# Altium schematic sheet Regulator.SchDoc
size A3
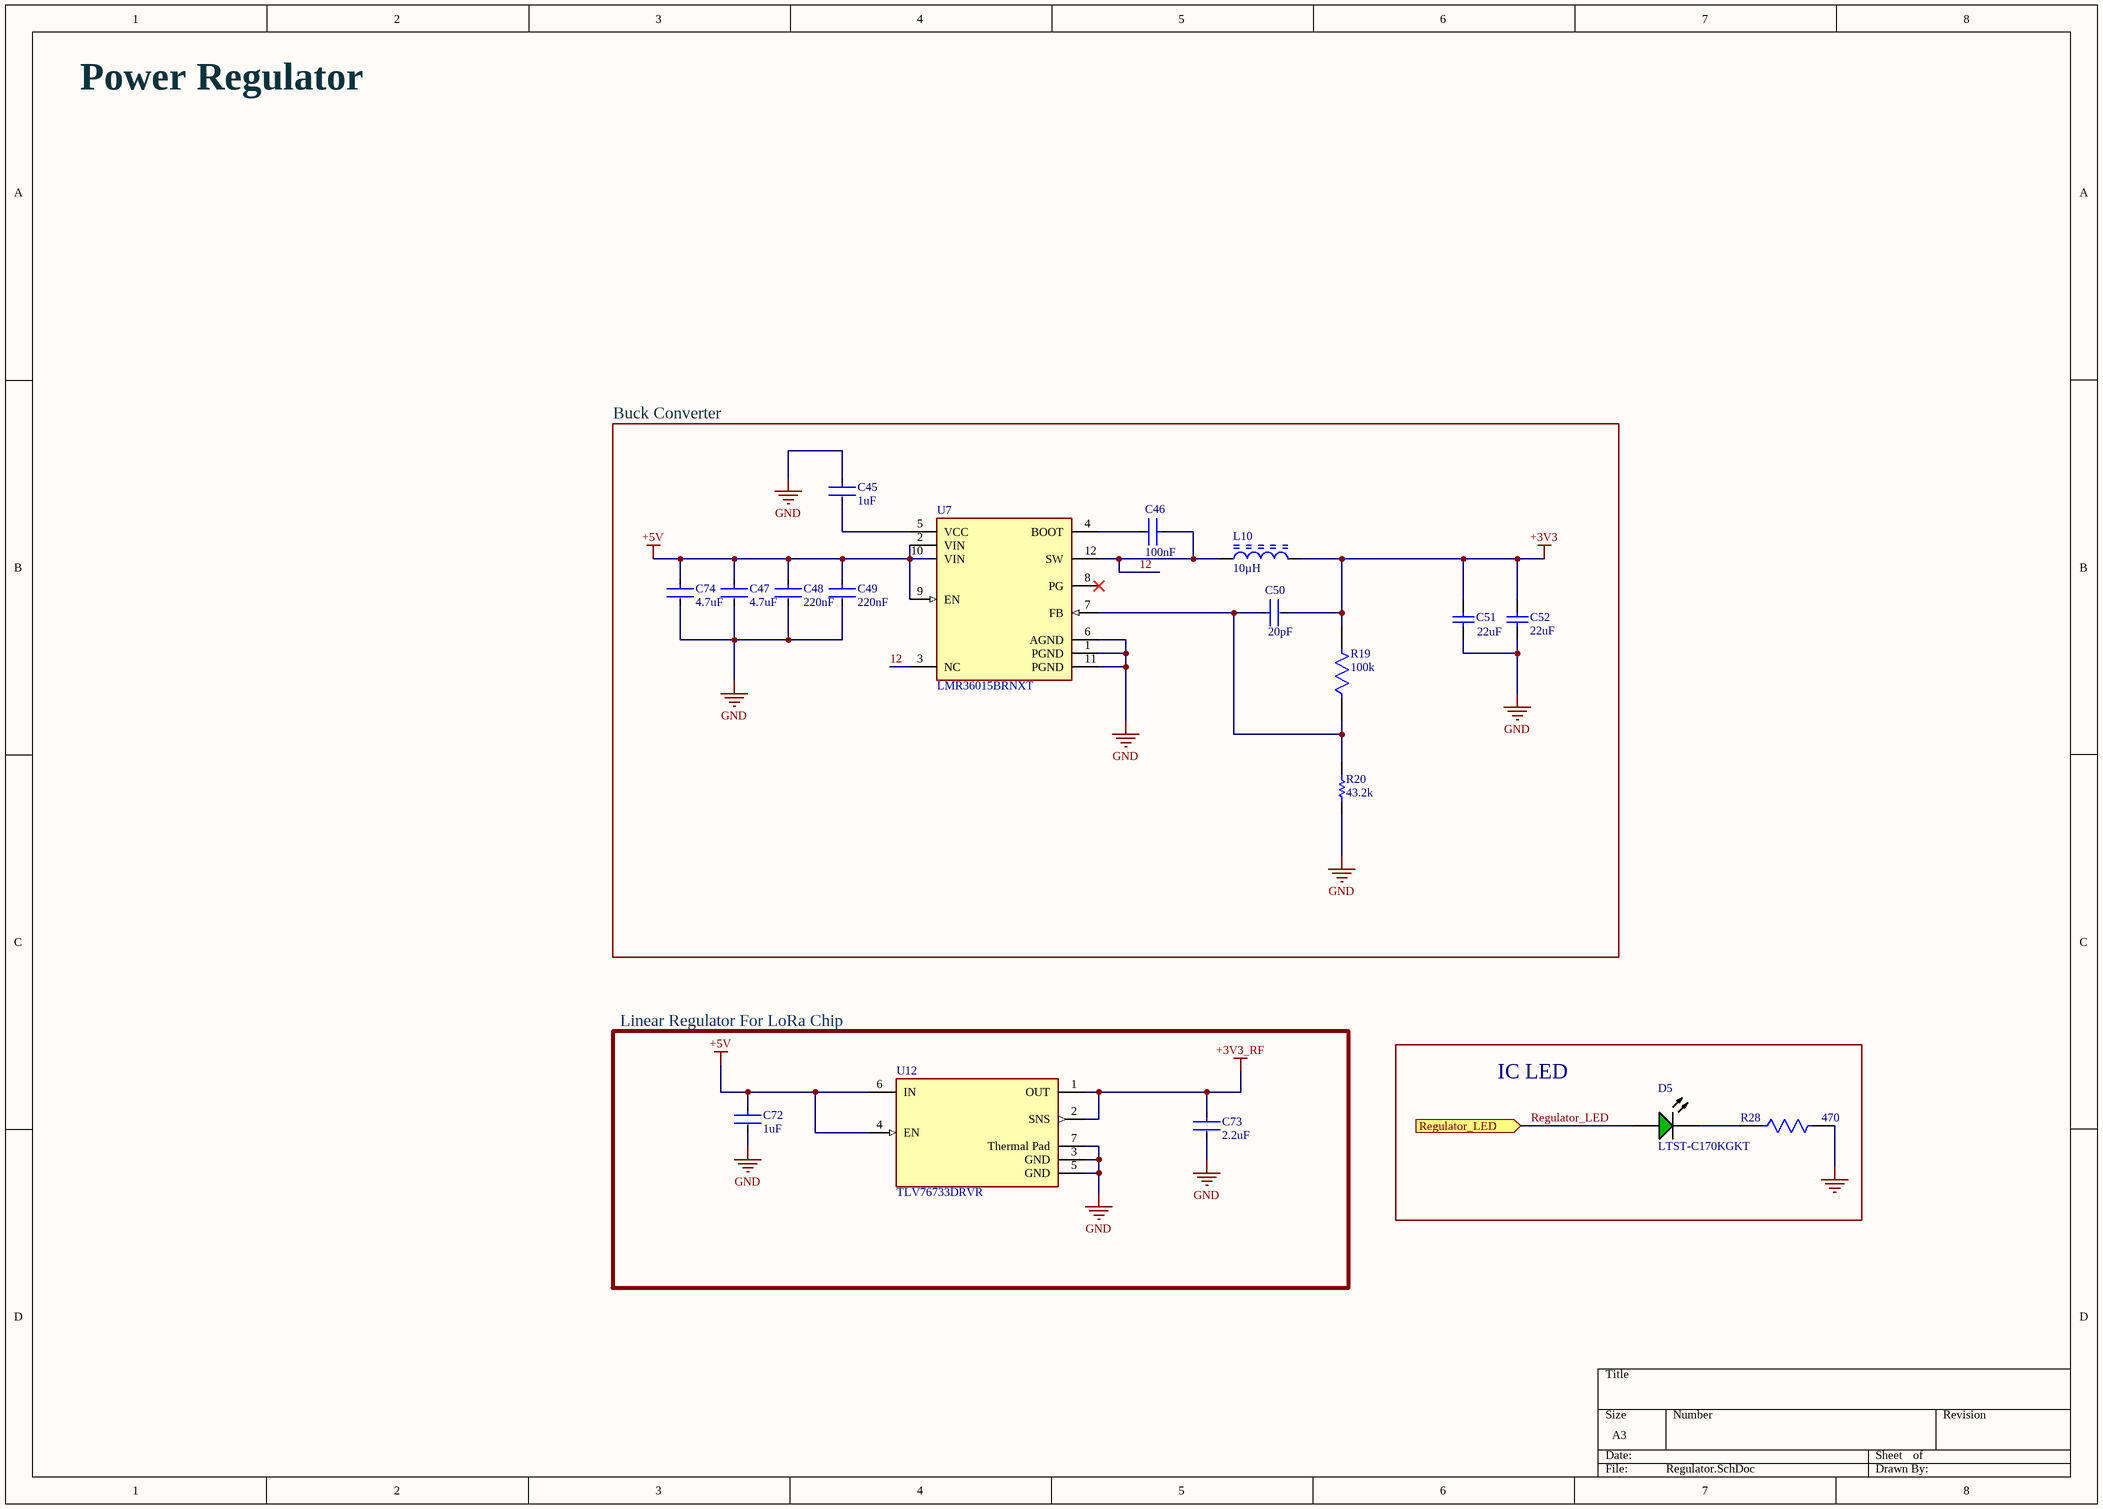
[diagram p0: Regulator.SchDoc]

## Parts
C45  1uF  [FP-C0603C105K4PACTU-MFG]
C46  100nF  [FP-GRM15-MFG]
C47  4.7uF  [FP-1210-L_3_3_0_4-W_2_5_0-IPC_B]
C48  220nF  [FP-GRM155-0_05-IPC_C]
C49  220nF  [FP-GRM155-0_05-IPC_C]
C50  20pF  [FP-GJM022-0_02-IPC_B]
C51  22uF  [MURA-1210_H_2.7_L]
C52  22uF  [MURA-1210_H_2.7_L]
C72  1uF  [FP-C0603C105K4PACTU-MFG]
C73  2.2uF  [FP-C1608-080-0_1-IPC_C]
C74  4.7uF  [FP-1210-L_3_3_0_4-W_2_5_0-IPC_B]
D5  LTST-C170KGKT  [LTST-LTST-C170KGKT-2_V]
L10  Inductance: 10µH  [BOUR-CM322522_V]  (hidden comment: CM322522-100KL)
R19  100k  [FP-CRCW0402-C-e3-MFG]
R20  43.2k  [RESC1005X40X25NL05T05]
R28  470  [FP-CPF0603-MFG]
U7  LMR36015BRNXT  [FP-RNX0012B-MFG]
U12  TLV76733DRVR  [FP-DRV0006A-IPC_C]

## Blocks framed on the sheet
Buck Converter: C45-C52 C74 L10 R19 R20 U7
Linear Regulator For LoRa Chip: C72 C73 U12
IC LED: D5 R28

## Ports
Regulator_LED (in, see MCU)

## Nets
+3V3: C50.2 C51.2 C52.2 L10.2 R19.2
+3V3_RF: C73.2 U12.1(OUT) U12.2(SNS)
+5V: C47.1 C48.1 C49.1 C72.1 C74.1 U7.2(VIN) U7.9(EN) U7.10(VIN) U12.4(EN) U12.6(IN)
GND: C45.1 C47.2 C48.2 C49.2 C51.1 C52.1 C72.2 C73.1 C74.2 R20.1 R28.2 U7.1(PGND) U7.6(AGND) U7.11(PGND) U12.3(GND) U12.5(GND) U12.7(Thermal_Pad)
12: C46.2 L10.1 U7.3(NC) U7.12(SW)
Regulator_LED: D5.2(A) ; port Regulator_LED
NetC45_2: C45.2 U7.5(VCC)
NetC46_1: C46.1 U7.4(BOOT)
NetC50_1: C50.1 R19.1 R20.2 U7.7(FB)
NetD5_1: D5.1(K) R28.1

Not connected (* = marked no-connect by the designer): U7 8(PG)*

## Notes on the sheet
- Power Regulator

## Library data of the parts
C45 C72 = CMP-2006-02279-2: CAP CER 1UF 16V X5R 0603; Tolerance: 10%; Dielectric Material: Ceramic; Dissipation Factor: 5%; Contact Plating: Tin; Width: 0.8mm; Case Code (Metric): 1608; Construction: Flat; Dielectric: X5R; Termination: SMD/SMT; Capacitance: 1uF; Package Quantity: 4000; Depth: 0.8mm; Min Operating Temperature: -55°C; Radiation Hardening: No; Voltage: 16V; Case Code (Imperial): 0603; Mount: Surface Mount; Max Operating Temperature: 85°C; Voltage Rating: 16V; Case/Package: 0603; Length: 1.6mm; Packaging: Tape and Reel; Height: 0.8mm; Voltage Rating (DC): 16V
C46 = CMP-2100-03641-2: CAP CER 0.1UF 16V X7R 0402; Manufacturer Part Number: GRM155R71C104KA88D; Manufacturer: Murata; Standoff Height: 0mm; Tolerance: 10%; Voltage Rating: 16Vdc; Material: Ceramic; Capacitance: 0.10μF; Value: 0.10μF; RoHS: TRUE; Temperature Characteristic: X7R; Octopart: https://octopart.com/grm155r71c104ka88d-murata-196880; Digikey Description: CAP CER 0.1UF 16V X7R 0402; Device Class L3: Ceramic Capacitors; Height: 0.55mm; ComponentLink2Description: Datasheet; Temperature Range Low: -55°C; Ipc Land Pattern Name: CAPC10050X219; ComponentLink2URL: https://search.murata.co.jp/Ceramy/image/img/A01X/G101/ENG/GRM155R71H471KA01-01A.pdf; Device Class L1: Passive Components; Lead Free: yes; Category: Cap; Package: GRM15; Temperature: -55°C to +125°C; Device Class L2: Capacitors; Temperature Range High: +125°C; Mouser Description: 0402 0.1 uF 16V ±10 % Tolerance X7R SMT Multilayer Ceramic Capacitor
C47 C74 = CMP-04427-009609-1: Automotive Ceramic Capacitor, 1210, 4.7uF, 10%, X7R, 15%, 16V; Length: 0.126inch; Case Code (Imperial): 1210; Width: 2.5mm; Max Operating Temperature: 125°C; Package Quantity: 1; Voltage Rating: 16V; Capacitance: 4.7uF; Case Code (Metric): 3225; Series: -; Case/Package: 1210; Dielectric: X7R; RoHS Compliant: Yes; Height: 2.29mm; Termination: SMD/SMT; Mount: Surface Mount; Packaging: Tape and Reel; Ratings: AEC-Q200; Voltage Rating (DC): 16V; Tolerance: 10%; Lead Free: Lead Free; Min Operating Temperature: -55°C
C48 C49 = CMP-1034-02089-3: Chip Multilayer Ceramic Capacitors for General Purpose, 0402, 0.22uF, X7R, 15%, 10%, 16V; Depth: 0.5mm; Dielectric: X7R; Capacitance: 220nF; Min Operating Temperature: -55°C; Package Quantity: 1; Termination: SMD/SMT; Mount: Surface Mount; Radiation Hardening: No; Height: 0.5mm; Case Code (Metric): 1005; Packaging: Tape and Reel; Material: Ceramic; Voltage: 16V; Voltage Rating (DC): 16V; REACH SVHC: No SVHC; Voltage Rating: 16V; Length: 1mm; Tolerance: 10%; Thickness: 0.022inch; Case Code (Imperial): 0402; Max Operating Temperature: 125°C; Width: 0.02inch; Lead Free: Lead Free; Case/Package: 0402
C50 = CMP-06035-052573-1: Ceramic Capacitor 20pF ±5% 16V C0G 01005 (0402 Metric); Package Quantity: 40000; Voltage Rating (DC): 16V; Case Code (Imperial): 1005; Lead Pitch: 0.13mm; Thickness: 0.009inch; Case/Package: 0402; Tolerance: 5%; Length: 0.016inch; Dielectric: C0G; Packaging: Tape and Reel; Voltage Rating: 16V; Termination: SMD/SMT; Case Code (Metric): 0402; Mount: Surface Mount; Capacitance: 20pF; Min Operating Temperature: -55°C; Width: 0.008inch; Max Operating Temperature: 125°C
C51 C52 = CMP-2000-06361-1: Chip Monolithic Ceramic Capacitor, 22 uF, +/- 10%, -55 to 85 degC, 2-Pin SMD (1210), RoHS, Tape and Reel; Manufacturer: Murata; Product Training Modules: High-CapMultilayerCeramicCapacitors; Other Names: 490-1882-2; Online Catalog: GRMSeries; Voltage Rating DC: 16V; Temperature Coefficient: X5R; Capacitance: 22µF; Catalog Drawings: GRMSeries_1210_2.5; Featured Product: GA3SafetyRecognizedCapsandHi-CapMLCC; Applications: GeneralPurpose; Lead Spacing: -; Ratings: -; Standard Package: 1,000; Lead Style: -; Size / Dimension: 0.126"Lx0.098"W(3.20mmx2.50mm); Features: -; Thickness (Max): 0.106"(2.70mm); Package Description: 2-Pin Surface Mount Device, Body 3.2 x 2.5 mm; Series: GRM; Mounting Type: SurfaceMount,MLCC; Category: Capacitors; Package / Case: 1210(3225Metric); Datasheet Version: 05/2014; Datasheet URL: https://datasheet.ciiva.com/26915/getdatasheetpartid-88858-26915376.pdf; Mounting Technology: SurfaceMount; Package Reference: 1210; Tolerance: ±10%; Packaging: Tape&Reel(TR); Operating Temperature: -55°C~85°C; Voltage - Rated: 16V; Height - Seated (Max): -; Family: CeramicCapacitors; Manufacturer URL: http://www.murata.com/
C73 = CMP-08246-005448-1: Multilayer Ceramic Capacitors 2.2μF ±10% 16V X5R SMD 0603; Length: 1.6mm; Mount: Surface Mount; Voltage Rating (DC): 16V; Case/Package: 0603; Voltage: 16V; Series: C; Resistor Type: Ceramic; Min Operating Temperature: -55°C; Tolerance: 10%; Capacitance: 2.2uF; Height: 0.8mm; Voltage Rating: 16V; Max Operating Temperature: 85°C; Dielectric Material: Ceramic; Radiation Hardening: No; Packaging: Tape and Reel; Weight: 7.1E-05oz; Termination: SMD/SMT; Case Code (Metric): 1608; RoHS Compliant: Yes; Width: 0.031inch; REACH SVHC: No SVHC; Construction: Flat; Thickness: 0.035inch; Dielectric: X5R; Lead Free: Lead Free; Case Code (Imperial): 0603; Depth: 0.8mm; Package Quantity: 1
D5 = CMP-2000-06620-1: Ultra Bright AlInGaP Chip LED, 75 mW, -55 to 85 degC, 2-Pin SMD (0805), RoHS, Tape and Reel; Manufacturer: Lite-On; Forward Current: 30mA; Power Dissipation Max: 75mW; Emitting Color: YellowGreen; Type: Uni-Color; Forward Voltage: 2.4V; Dominant Wave Length: 571nm; Test Current (It): 20mA; Product Length (mm): 2mm; Peak Wavelength: 574nm; Power Dissipation: 75W; Product Depth (mm): 1.25mm; DELETED: Compliant; High Brightness: Yes; Product Height (mm): 1.1mm; Luminous Intensity: 35mcd; Shape Type: Rectangular; Chip Material: AlGaInP; Viewing Angle: 130deg; Number of  Elements: 1; Reverse Voltage: 5V; Rad Hardened: No; Package Type: ChipLed; Manufacturer URL: http://www.us.liteon.com/; Mounting: SurfaceMount; Operating Temp Range: -55Cto85C; Datasheet URL: http://optoelectronics.liteon.com/upload/download/DS22-2000-073/S_110_LTST-C170KGKT.pdf; Packaging: TapeandReel; Pin Count: 2; Package Description: 2-Pin Surface Mounted Device, Body 2 x 1.25 mm; Mounting Technology: SurfaceMount; Package Reference: LTST-C170KGKT-2; Forward Current Max: 30mA; Datasheet Version: Rev. G, 06/2005; Lens Dimensions: 1.4x1.25x0.6mm; Operating Temperature Classification: Industrial; Lum Intensity: 35mcd; Main Category: ChipLED
L10 = CMP-006-00005-3: Chip Inductor, 10 uH, +/- 10%, -40 to 125 degC, 1210 (3225 Metric), RoHS, Tape and Reel; Manufacturer: Bourns; Current Rating: 140mA; Q Factor: 30; Self Resonant Frequency: 30MHz; Core Material: Ferrite; Shielding: Unshielded; Resistance: 2.1Ohm; Mounting Technology: SM; Min Operating Temperature: -20°C; Datasheet URL: http://www.murata.com/~/media/webrenewal/support/library/catalog/products/emc/emifil/c30e.ashx?la=en-gb; Case/Package: 1210; Pins: 2; Package Description: 2-Pin Surface Mount Device, Body 3.2 x 2.5 mm; RoHS Compliant: True; Max Operating Temperature: 100°C; Inductance Tolerance: 10%; Package Reference: 1210; Packaging: TapeandReel; Package Quantity: 1; Datasheet Version: Aug-14; Tolerance: 10%
R19 = CMP-02407-010951-1: RES 100K OHM 1% 1/16W 0402; Temperature Coefficient: 100ppm/°C; Power Rating: 62.5mW; Resistance: 100kR; Lead Free: Lead Free; Length: 1mm; Tolerance: 1%; Resistor Type: Thick Film; Contact Plating: Tin; Case/Package: SMD/SMT; Min Operating Temperature: -55°C; RoHS Compliant: Yes; Termination: Wraparound; Max Operating Temperature: 155°C; Mount: Surface Mount
R20 = CMP-1011-00695-2: Part Number: CRCW040243K2FKED; Manufacturer: Vishay Dale
R28 = CMP-03211-004765-1: RES SMD 470Ω 0.1% 1/16W 0603 / CPF0603B470RE; Manufacturer: TE Connectivity; Temperature Coefficient: 25ppm/°C; Voltage Rating: 50V; Power Rating: 0.063W; Value: 470Ω; Device Class L3: Chip SMD Resistors; RoHS: TRUE; Category: Res; Device Class L2: Resistors; Series: CPF; Height: 0.55mm; Temperature: -55°C to +155°C; Temperature Range High: +155°C; Automotive: No; octopart_url: https://octopart.com/cpf0603b470re-te+connectivity-23376607; packaging: 5k Reel; ComponentLink2Description: Datasheet; Temperature Range Low: -55°C; Device Class L1: Passive Components; Ipc Land Pattern Name: RESC15580X45; Package: CPF0603; Composition: Thin Film; Manufacturer Part Number: CPF0603B470RE; Resistance: 470Ω; Octopart: https://octopart.com/cpf0603b470re-te+connectivity-23376607; Lead Free: Yes; ComponentLink2URL: https://www.te.com/commerce/DocumentDelivery/DDEController?Action=showdoc&DocId=Data+Sheet%7F1773200%7FM%7Fpdf%7FEnglish%7FENG_DS_1773200_M.pdf%7F3-1676481-2; Tolerance: 0.1%
U7 = CMP-04918-000354-1: IC REGULATOR BUCK
U12 = CMP-04917-000203-1: VOLTAGE COMPARATOR